# EAGLE design SWITCHER (EAGLE 5.04)
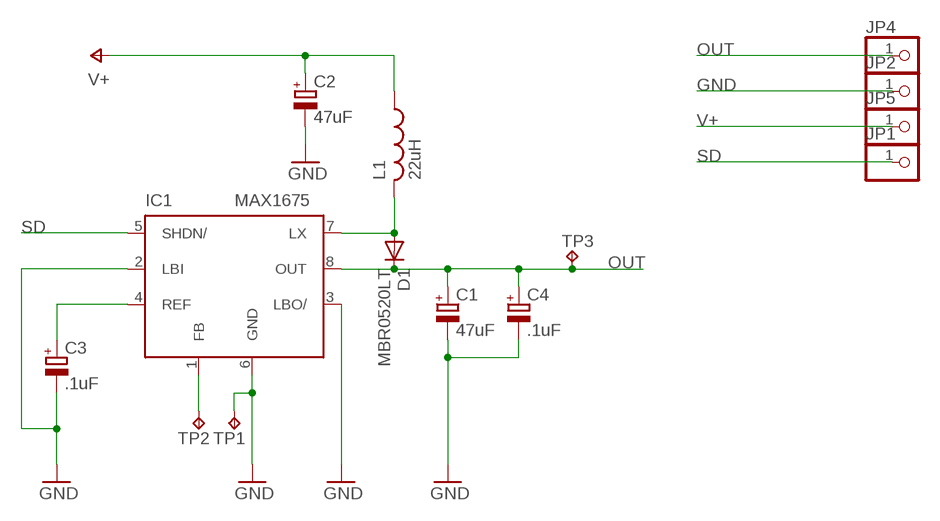
[diagram p0: schematic, sheet 1]

## Parts
C1  47uF  CPOL-EUCT6032  [CT6032]
C2  47uF  CPOL-EUCT6032  [CT6032]
C3  .1uF  CPOL-EUR/2012-12R  [R/2012-12R]
C4  .1uF  CPOL-EUR/2012-12R  [R/2012-12R]
D1  MBR0520LT  [SOD123]
IC1  MAX1675  [UMAX8]
JP1  PINHD-1X1  [1X01]
JP2  PINHD-1X1  [1X01]
JP4  PINHD-1X1  [1X01]
JP5  PINHD-1X1  [1X01]
L1  22uH  L-US  [ELL6SH]
TP1  TPTP10SQ  [TP10SQ]
TP2  TPTP10SQ  [TP10SQ]
TP3  TPTP10SQ  [TP10SQ]

## Nets
FB: IC1.1(FB) TP2.TP
GND: C1.- C2.- C3.- C4.- IC1.2(LBI) IC1.3(LBO/) IC1.6(GND) JP2.1 TP1.TP
N$4: D1.A IC1.7(LX) L1.2
N$5: C3.+ IC1.4(REF)
OUT: C1.+ C4.+ D1.C IC1.8(OUT) JP4.1 TP3.TP
SD: IC1.5(SHDN/) JP1.1
V+: C2.+ JP5.1 L1.1

## Library data of the parts
C1-C4 = rcl:CPOL-EU: POLARIZED CAPACITOR, European symbol
D1 = diode:MBR0520LT: SCHOTTKY BARRIER RECTIFIER Source: http://onsemi.com .. MBR0520LT1-D.pdf
IC1 = maxim:MAX1675: DC/DC CONVERTER
JP1 JP2 JP4 JP5 = pinhead:PINHD-1X1: PIN HEADER
L1 = rcl:L-US: INDUCTOR, American symbol
TP1-TP3 = testpad:TP: Test pad

## Board
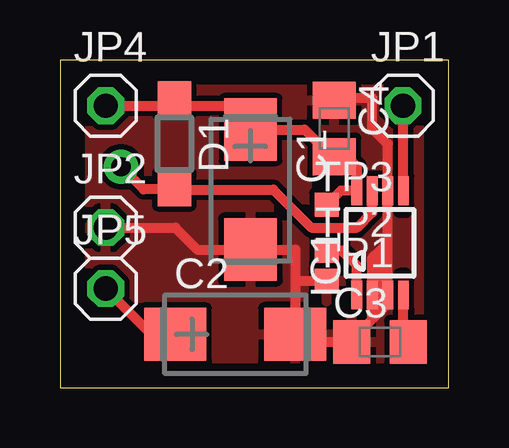
[diagram p1: board, top side]
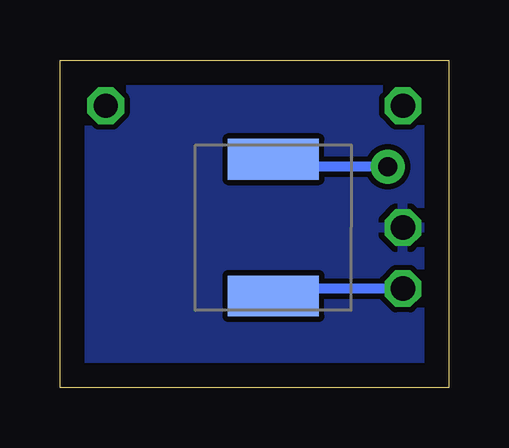
[diagram p2: board, bottom side, seen from below]

Size 16.19 x 13.65 mm. Coordinates in mm from the lower left corner, seen from the top.
Outline: 0,0 16.19,0 16.19,13.65 0,13.65 0,0
Copper layers (1*16): Top 0.035mm / dielectric 1.5mm / Bottom 0.035mm
Design rules "default": minimum track width 10mil, minimum drill 24mil, track to track 8mil, track to pad 8mil, pad to pad 8mil, via to via 8mil, smd to smd 8mil, copper to edge 40mil, drill to drill 8mil, minimum pad ring 10mil, minimum via ring 8mil, stop-mask expansion 4mil, vias tented up to drill 0mil, thermal gap 10mil
tRestrict: area 14.1,4.4 to 14.4,4.8; area 14.1,7.3 to 14.4,7.6

### Footprints (pad centres in the part's own frame; a part is rotated, then mirrored left to right if it is on the bottom)
CT6032 = smd 2.6 x 2.2: + -2.5,0; - 2.5,0
R/2012-12R = smd 1.55 x 1.8: + 1.175,0; - -1.175,0
SOD123 = smd 1.4 x 1.4: A 1.9,0; C -1.9,0
UMAX8 = smd 0.45 x 1.2: 1 -0.975,-2.175; 2 -0.325,-2.175; 3 0.325,-2.175; 4 0.975,-2.175; 5 0.975,2.175; 6 0.325,2.175; 7 -0.325,2.175; 8 -0.975,2.175
1X01 = drill 1.016 octagon: 1 0,0
ELL6SH = smd 1.7 x 3.8: 1 -2.85,0; 2 2.85,0
TP10SQ = smd 1 x 1: TP 0,0

### Placement (x,y rotation side)
C1  7.94,8.26 270 top
C2  7.3,2.22 0 top
C3  13.34,1.91 0 top
C4  11.43,10.79 270 top
D1  4.76,10.16 270 top
IC1  13.34,6.03 0 top
JP1  14.29,11.75 0 top
JP2  1.91,6.67 0 top
JP4  1.91,11.75 0 top
JP5  1.91,4.13 0 top
L1  7.3,6.67 90 bottom
TP1  11.11,4.45 0 top
TP2  11.11,5.71 0 top
TP3  11.11,7.62 0 top

### Tracks (layer width: path | path; a pad name or v marks a point on that pad's centre or on a via)
FB
  Top 0.406: IC1.1 12.36,5.1 11.75,5.71 TP2.TP
GND
  Top 0.406: C2.- 8.89,2.26 | 12.06,11.75 11.43,11.75 C4.- 11.43,12.06 13.02,12.06 13.02,10.79 13.66,10.15 IC1.6 IC1.3 13.66,3.5 13.02,2.86 | C2.- 9.8,1.91 C3.- 12.7,2.44 12.7,2.54 13.02,2.86 | C2.- 10.48,2.22 | C2.- 9.8,3.13 | 9.8,4.45 9.8,5.75 C1.- 5.71,5.75 4.8,6.67 JP2.1 | 9.8,4.45 C2.- | 9.8,4.45 TP1.TP | 13.01,4.43 IC1.2 | 13.02,2.86 13.01,4.43 | 13.01,4.43 13.01,5.39 13.34,5.71 | 13.34,5.71 13.65,6.03 | 13.34,5.71 13.34,3.49
  pour Bottom (isolate 0.229): 0,13.65 16.19,13.65 16.19,0 0,0
  pour Top (isolate 0.229): 0,13.65 16.19,13.65 16.19,0 0,0
N$4  (via drill 0.8 pad 1.42)
  Top 0.406: IC1.7 13.02,7.3 12.38,6.67 10.48,6.67 8.89,8.26 D1.A 3.49,8.26 v2.54,9.21
  Bottom 0.406: v2.54,9.21 7.3,9.21 L1.2
N$5
  Top 0.406: C3.+ 14.31,1.79 | C3.+ 14.31,1.59 | IC1.4 14.31,1.91 C3.+
OUT
  Top 0.406: TP3.TP 11.7,8.21 IC1.8 12.36,9.23 12.06,9.53 12.06,9.62 C4.+ 11.33,9.62 10.2,10.76 C1.+ 7.94,11.74 4.76,11.74 D1.C 4.76,11.75 JP4.1
SD
  Top 0.406: IC1.5 14.31,11.75 JP1.1
V+
  Top 0.406: C2.+ 3.81,2.22 JP5.1
  Bottom 0.406: L1.1 7.3,4.13 JP5.1